# EAGLE design CYM1A113 (EAGLE 7.7.0)
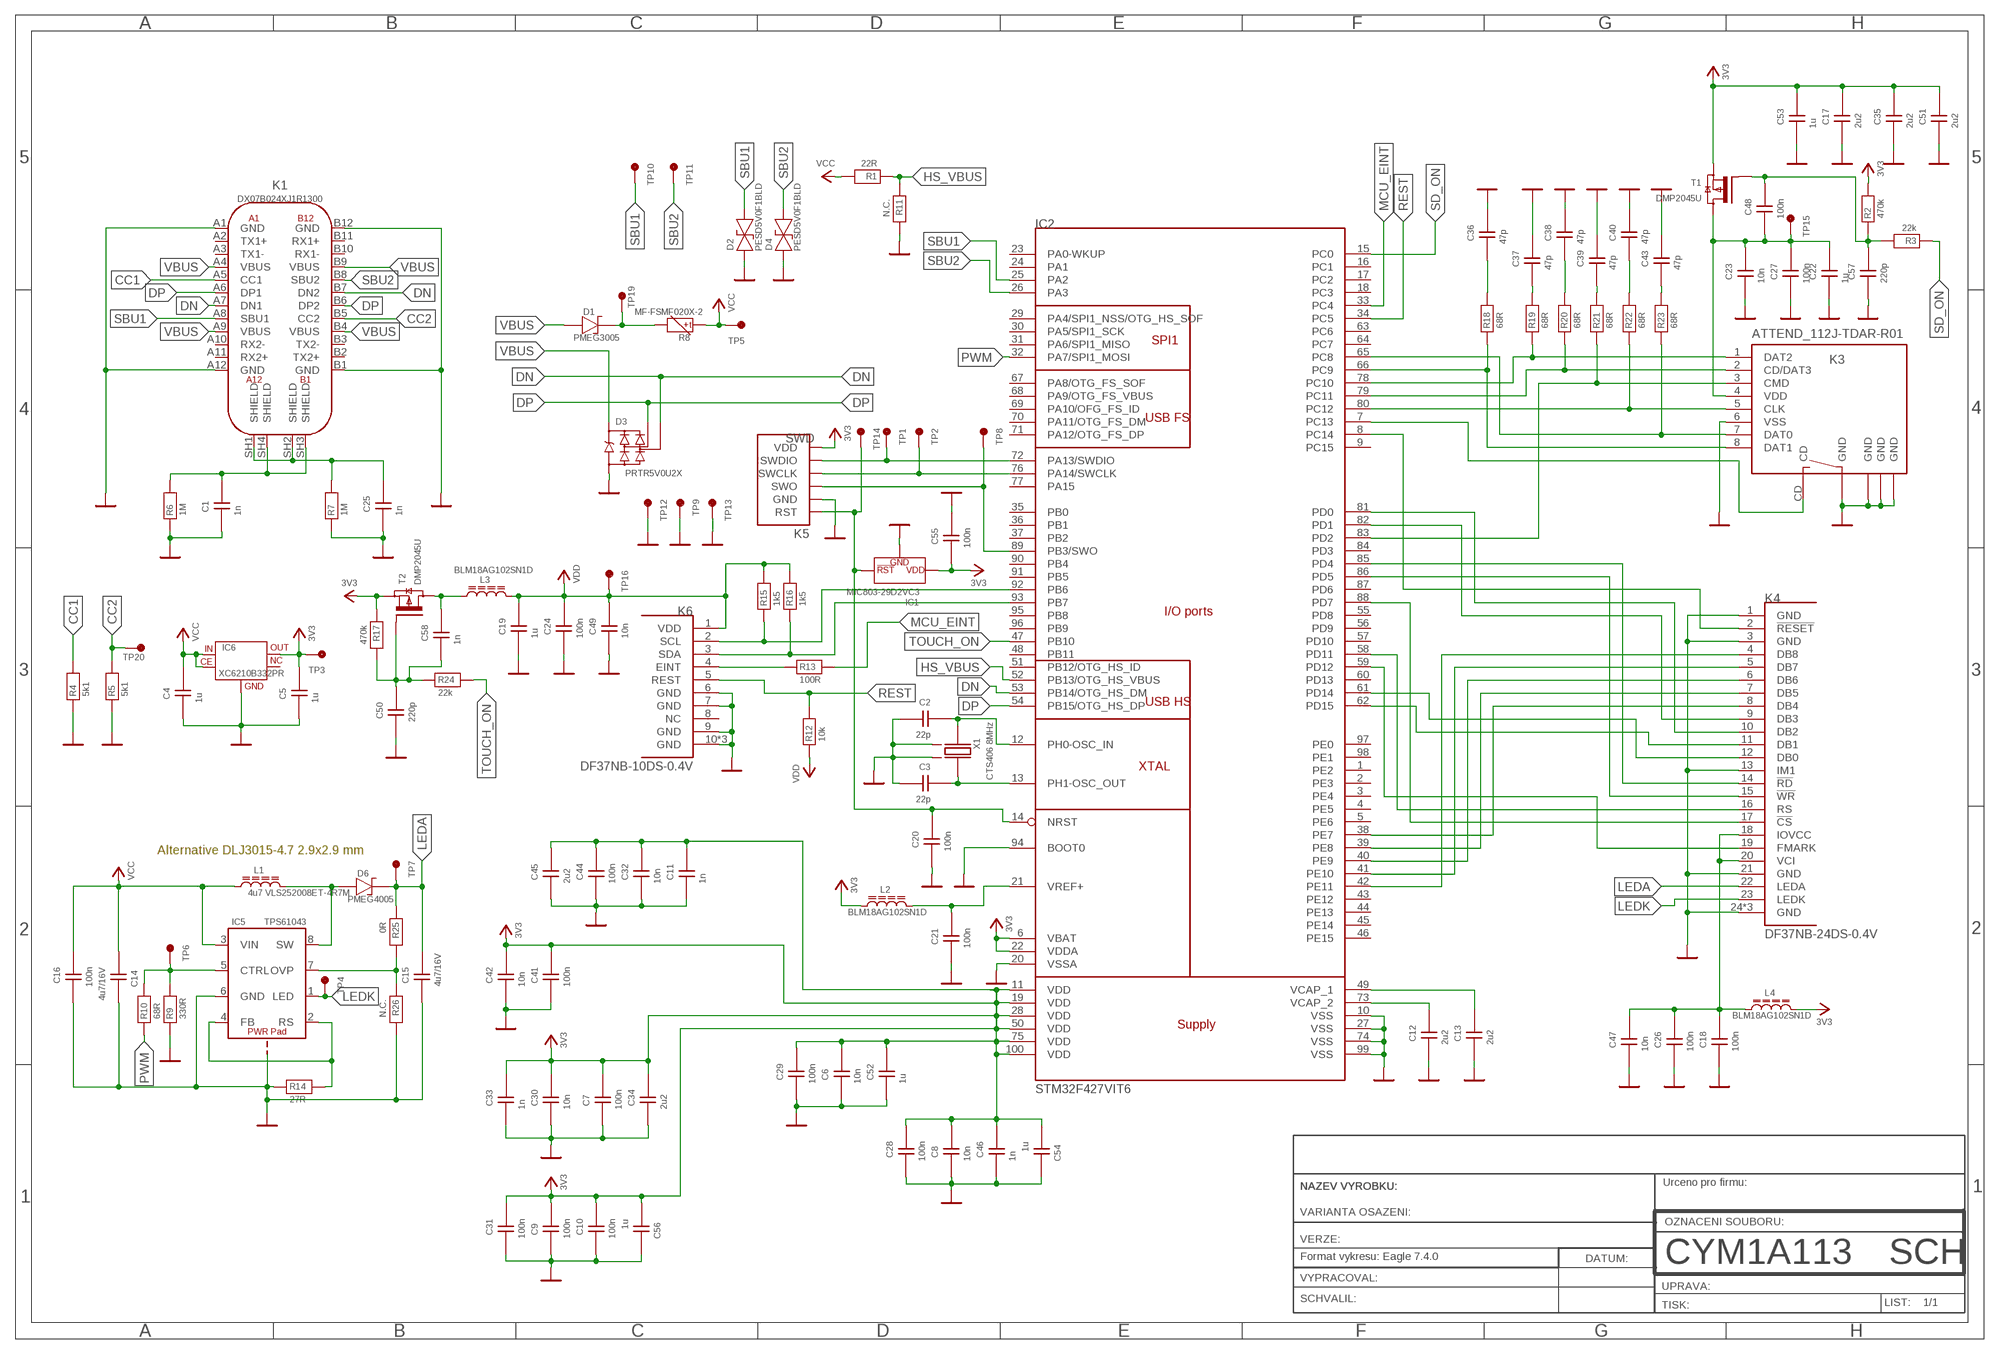
[diagram p0: schematic, sheet 1]

## Parts
C1  1n  C_0402  [0402]
C2  22p  C_0402  [0402]
C3  22p  C_0402  [0402]
C4  1u  C_0603$REFLOW  [0603_REFLOW]
C5  1u  C_0603  [0603]
C6  10n  C_0402  [0402]
C7  100n  C_0402  [0402]
C8  10n  C_0402  [0402]
C9  100n  C_0402  [0402]
C10  100n  C_0402  [0402]
C11  1n  C_0402  [0402]
C12  2u2  C_0805$REFLOW  [0805_REFLOW]
C13  2u2  C_0805$REFLOW  [0805_REFLOW]
C14  4u7/16V  C_0805$REFLOW  [0805_REFLOW]
C15  4u7/16V  C_0805$REFLOW  [0805_REFLOW]
C16  100n  C_0402  [0402]
C17  2u2  C_0805$REFLOW  [0805_REFLOW]
C18  100n  C_0402  [0402]
C19  1u  C_0603$REFLOW  [0603_REFLOW]
C20  100n  C_0402  [0402]
C21  100n  C_0402  [0402]
C22  1u  C_0603$REFLOW  [0603_REFLOW]
C23  10n  C_0402  [0402]
C24  100n  C_0402  [0402]
C25  1n  C_0402  [0402]
C26  100n  C_0402  [0402]
C27  100n  C_0402  [0402]
C28  100n  C_0402  [0402]
C29  100n  C_0402  [0402]
C30  10n  C_0402  [0402]
C31  100n  C_0402  [0402]
C32  10n  C_0402  [0402]
C33  1n  C_0402  [0402]
C34  2u2  C_0805$REFLOW  [0805_REFLOW]
C35  2u2  C_0805$REFLOW  [0805_REFLOW]
C36  47p  C_0402  [0402]
C37  47p  C_0402  [0402]
C38  47p  C_0402  [0402]
C39  47p  C_0402  [0402]
C40  47p  C_0402  [0402]
C41  100n  C_0402  [0402]
C42  10n  C_0402  [0402]
C43  47p  C_0402  [0402]
C44  100n  C_0402  [0402]
C45  2u2  C_0805$REFLOW  [0805_REFLOW]
C46  1n  C_0402  [0402]
C47  10n  C_0402  [0402]
C48  100n  C_0402  [0402]
C49  10n  C_0402  [0402]
C50  220p  C_0402  [0402]
C51  2u2  C_0805$REFLOW  [0805_REFLOW]
C52  1u  C_0603$REFLOW  [0603_REFLOW]
C53  1u  C_0603$REFLOW  [0603_REFLOW]
C54  1u  C_0603$REFLOW  [0603_REFLOW]
C55  100n  C_0402  [0402]
C56  1u  C_0603$REFLOW  [0603_REFLOW]
C57  220p  C_0402  [0402]
C58  1n  C_0402  [0402]
D1  PMEG3005  DS_SOD323F  [SOD323F]
D2  PESD5V0F1BLD  D_TRANSIL_BI_SOD882D  [SOD882D]
D3  PRTR5V0U2X  PRTR5V0_SOT143B$REFLOW  [SOT143B_REFLOW]
D4  PESD5V0F1BLD  D_TRANSIL_BI_SOD882D  [SOD882D]
D6  PMEG4005  DS_SOD323F  [SOD323F]
IC1  MIC803-29D2VC3  MIC803  [SOT23_MEDIUM_SIZE]
IC2  STM32F427VIT6  STM32F427_LQFP100  [LQFP100_NO_CENTER_NO_TDOCU]
IC5  TPS61043  TP6104X_WSON-8_3X3MM  [WSON-8_3X3MM]
IC6  XC6210B332PR  XC6210B_SOT89-5  [SOT89-5]
K1  DX07B024XJ1R1300  USB-C_JAE_DX07B024XJ1  [USB_C_JAE_DX07B024XJ1]
K3  ATTEND_112J-TDAR-R01  KON_µSD_CARD_ATTEND_112J_TXAR_R01_SMALL  [ATTEND_112J-TXAR-R01_SMALL]
K4  DF37NB-24DS-0.4V  DISPLEJ_154A2411CTP01  [DF37NB-24DS-0.4V]
K5  SWD  [SWD]
K6  DF37NB-10DS-0.4V  DISPLEJ_154A2411CTP01_TOUCH  [DF37NB-10DS-0.4V]
L1  4u7 VLS252008ET-4R7M  L_2.5X2.0  [L_2.5X2.0]
L2  BLM18AG102SN1D  L_0603$REFLOW  [0603_REFLOW]
L3  BLM18AG102SN1D  L_0603$REFLOW  [0603_REFLOW]
L4  BLM18AG102SN1D  L_0603$REFLOW  [0603_REFLOW]
R1  22R  R_0402  [0402]
R2  470k  R_0402  [0402]
R3  22k  R_0402  [0402]
R4  5k1  R_0402  [0402]
R5  5k1  R_0402  [0402]
R6  1M  R_0402  [0402]
R7  1M  R_0402  [0402]
R8  MF-FSMF020X-2  POLYSWITCH_0603  [0603]
R9  330R  R_0402  [0402]
R10  68R  R_0402  [0402]
R11  N.C.  R_0402  [0402]
R12  10k  R_0402  [0402]
R13  100R  R_0402  [0402]
R14  27R  R_0402  [0402]
R15  1k5  R_0402  [0402]
R16  1k5  R_0402  [0402]
R17  470k  R_0402  [0402]
R18  68R  R_0402  [0402]
R19  68R  R_0402  [0402]
R20  68R  R_0402  [0402]
R21  68R  R_0402  [0402]
R22  68R  R_0402  [0402]
R23  68R  R_0402  [0402]
R24  22k  R_0402  [0402]
R25  0R  R_0402  [0402]
R26  N.C.  R_0402  [0402]
T1  DMP2045U  PMOS_SOT-23_REF  [SOT23_REFLOW]
T2  DMP2045U  PMOS_SOT-23_REF  [SOT23_REFLOW]
TP1  MB_1.27  [MB1.27]
TP2  MB_1.27  [MB1.27]
TP3  MB_1.50  [MB1.5]
TP4  MB_1.27  [MB1.27]
TP5  MB_1.50  [MB1.5]
TP6  MB_1.27  [MB1.27]
TP7  MB_1.27  [MB1.27]
TP8  MB_1.27  [MB1.27]
TP9  MB_1.27  [MB1.27]
TP10  MB_1.50  [MB1.5]
TP11  MB_1.50  [MB1.5]
TP12  MB_1.27  [MB1.27]
TP13  MB_1.27  [MB1.27]
TP14  MB_1.27  [MB1.27]
TP15  MB_1.27  [MB1.27]
TP16  MB_1.27  [MB1.27]
TP19  MB_1.00  [MB_1.00]
TP20  MB_1.00  [MB_1.00]
X1  CTS406 8MHz  X_4V_6,0X3,5  [X6,0X3,5]

## Nets
CC1: K1.A5(CC1) R4.P$2
CC2: K1.B5(CC2) R5.P$2 TP20.1
CTRL: IC5.5(CTRL) R9.P$2 R10.P$2 TP6.1
DISP_!CS: IC2.88(PD7) K4.17(!CS)
DISP_!RD: IC2.85(PD4) K4.14(!RD)
DISP_!RESET: IC2.8(PC14) K4.2(!RESET)
DISP_!WR: IC2.86(PD5) K4.15(!WR)
DISP_DB0: IC2.61(PD14) K4.12(DB0)
DISP_DB1: IC2.62(PD15) K4.11(DB1)
DISP_DB2: IC2.81(PD0) K4.10(DB2)
DISP_DB3: IC2.82(PD1) K4.9(DB3)
DISP_DB4: IC2.38(PE7) K4.8(DB4)
DISP_DB5: IC2.39(PE8) K4.7(DB5)
DISP_DB6: IC2.40(PE9) K4.6(DB6)
DISP_DB7: IC2.41(PE10) K4.5(DB7)
DISP_DB8: IC2.42(PE11) K4.4(DB8)
DISP_FMARK: IC2.59(PD12) K4.19(FMARK)
DISP_RS: IC2.58(PD11) K4.16(RS)
DISP_VCC: C18.P$2 C26.P$2 C47.P$2 K4.18(IOVCC) K4.20(VCI) L4.1
DN: D3.3(I/O2) IC2.53(PB14/OTG_HS_DM) K1.A7(DN1) K1.B7(DN2)
DP: D3.2(I/O1) IC2.54(PB15/OTG_HS_DP) K1.A6(DP1) K1.B6(DP2)
EINT: K6.4(EINT) R13.P$1
FB_RS: IC5.2(RS) IC5.4(FB) R14.P$2
GND: C1.P$1 C2.P$1 C3.P$1 C4.1 C5.1 C6.P$1 C7.P$1 C8.P$1 C9.P$1 C10.P$1 C11.P$1 C12.1 C13.1 C14.2 C15.1 C16.P$1 C17.1 C18.P$1 C19.1 C20.P$1 C21.P$1 C22.1 C23.P$1 C24.P$1 C25.P$1 C26.P$1 C27.P$1 C28.P$1 C29.P$1 C30.P$1 C31.P$1 C32.P$1 C33.P$1 C34.1 C35.1 C36.P$2 C37.P$2 C38.P$2 C39.P$2 C40.P$2 C41.P$1 C42.P$1 C43.P$2 C44.P$1 C45.1 C46.P$1 C47.P$1 C49.P$1 C50.P$1 C51.1 C52.1 C53.1 C54.2 C55.P$2 C56.2 C57.P$1 D2.1 D3.1(GND) D4.1 IC1.1(GND) IC2.10(VSS) IC2.20(VSSA) IC2.27(VSS) IC2.74(VSS) IC2.94(BOOT0) IC2.99(VSS) IC5.6(GND) IC5.EP IC5.EP$1(EP) IC5.EP$2(EP) IC5.EP$3(EP) IC5.EP$4(EP) IC6.2(GND) K1.A1(GND) K1.A12(GND) K1.B1(GND) K1.B12(GND) K3.6(VSS) K3.GND@1(GND) K3.GND@2(GND) K3.GND@3(GND) K3.GND@4(GND) K4.1(GND) K4.3(GND) K4.13(IM1) K4.21(GND) K4.24(GND) K4.25(GND) K4.26(GND) K5.GND K6.6(GND) K6.7(GND) K6.9(GND) K6.10(GND) K6.11(GND) K6.12(GND) R4.P$1 R5.P$1 R6.P$1 R7.P$1 R9.P$1 R11.P$2 R14.P$1 R26.P$2 TP9.1 TP12.1 TP13.1 X1.2(GND1) X1.4(GND2)
HS_VBUS: IC2.52(PB13/OTG_HS_VBUS) R1.P$1 R11.P$1
LEDA: C15.2 D6.K K4.22(LEDA) R25.P$1 TP7.1
LEDK: IC5.1(LED) K4.23(LEDK) TP4.1
MCU_EINT: IC2.33(PC4) R13.P$2
N$1: C58.P$2 L3.1 T2.3(D)
N$2: C1.P$2 K1.SH3(SHIELD) K1.SH4(SHIELD) R6.P$2
N$3: C25.P$2 K1.SH1(SHIELD) K1.SH2(SHIELD) R7.P$2
N$4: C36.P$1 R18.P$2
N$6: C37.P$1 R19.P$2
N$7: C38.P$1 R20.P$2
N$13: C39.P$1 R21.P$2
N$16: C40.P$1 R22.P$2
N$17: C43.P$1 R23.P$2
N$20: C22.2 C23.P$2 C27.P$2 C48.P$1 K3.4(VDD) T1.3(D) TP15.1
N$21: C2.P$2 IC2.12(PH0-OSC_IN) X1.1
N$22: C3.P$2 IC2.13(PH1-OSC_OUT) X1.3
N$23: C48.P$2 C57.P$2 R2.P$1 R3.P$2 T1.2(G)
N$24: D1.K R8.2 TP19.1
N$25: C12.2 IC2.73(VCAP_2)
N$26: C13.2 IC2.49(VCAP_1)
N$27: C50.P$2 C58.P$1 R17.P$2 R24.P$1 T2.2(G)
OVP: IC5.7(OVP) R25.P$2 R26.P$1
PWM: IC2.32(PA7/SPI1_MOSI) R10.P$1
REST: IC2.34(PC5) K6.5(REST) R12.P$2
RST: C20.P$2 IC1.2(RES) IC2.14(NRST) K5.RST TP14.1
SBU1: D2.2 IC2.25(PA2) K1.A8(SBU1) TP10.1
SBU2: D4.2 IC2.26(PA3) K1.B8(SBU2) TP11.1
SCL: IC2.92(PB6) K6.2(SCL) R15.P$1
SD_CD: IC2.7(PC13) K3.CD
SD_CLK: IC2.80(PC12) K3.5(CLK) R22.P$1
SD_CMD: IC2.83(PD2) K3.3(CMD) R21.P$1
SD_DAT0: IC2.65(PC8) K3.7(DAT0) R23.P$1
SD_DAT1: IC2.66(PC9) K3.8(DAT1) R18.P$1
SD_DAT2: IC2.78(PC10) K3.1(DAT2) R19.P$1
SD_DAT3: IC2.79(PC11) K3.2(CD/DAT3) R20.P$1
SD_ON: IC2.15(PC0) R3.P$1
SDA: IC2.93(PB7) K6.3(SDA) R16.P$1
SW: D6.A IC5.8(SW) L1.2
SWCLK: IC2.76(PA14/SWCLK) K5.SWCLK TP2.1
SWDIO: IC2.72(PA13/SWDIO) K5.SWDIO TP1.1
SWO: IC2.89(PB3/SWO) K5.SWO TP8.1
TOUCH_ON: IC2.47(PB10) R24.P$2
VBUS: D1.A D3.4(VCC) K1.A4(VBUS) K1.A9(VBUS) K1.B4(VBUS) K1.B9(VBUS)
VCC: C4.2 C14.1 C16.P$2 IC5.3(VIN) IC6.1(CE) IC6.4(IN) L1.1 R1.P$2 R8.1 TP5.1
VCC-2: C5.2 C6.P$2 C7.P$2 C8.P$2 C9.P$2 C10.P$2 C11.P$2 C17.2 C28.P$2 C29.P$2 C30.P$2 C31.P$2 C32.P$2 C33.P$2 C34.2 C35.2 C41.P$2 C42.P$2 C44.P$2 C45.2 C46.P$2 C51.2 C52.2 C53.2 C54.1 C55.P$1 C56.1 IC1.3(VDD) IC2.6(VBAT) IC2.11(VDD) IC2.19(VDD) IC2.22(VDDA) IC2.28(VDD) IC2.50(VDD) IC2.75(VDD) IC2.100(VDD) IC6.5(OUT) K5.VCC(VDD) L2.1 L4.2 R2.P$2 R17.P$1 T1.1(S) T2.1(S) TP3.1 ; supply symbol labelled 3V3
VDD: C19.2 C24.P$2 C49.P$2 K6.1(VDD) L3.2 R12.P$1 R15.P$2 R16.P$2 TP16.1
VREF+: C21.P$2 IC2.21(VREF+) L2.2
Unconnected: IC2.1(PE2) IC2.2(PE3) IC2.3(PE4) IC2.4(PE5) IC2.5(PE6) IC2.9(PC15) IC2.16(PC1) IC2.17(PC2) IC2.18(PC3) IC2.23(PA0-WKUP) IC2.24(PA1) IC2.29(PA4/SPI1_NSS/OTG_HS_SOF) IC2.30(PA5/SPI1_SCK) IC2.31(PA6/SPI1_MISO) IC2.35(PB0) IC2.36(PB1) IC2.37(PB2) IC2.43(PE12) IC2.44(PE13) IC2.45(PE14) IC2.46(PE15) IC2.48(PB11) IC2.51(PB12/OTG_HS_ID) IC2.55(PD8) IC2.56(PD9) IC2.57(PD10) IC2.60(PD13) IC2.63(PC6) IC2.64(PC7) IC2.67(PA8/OTG_FS_SOF) IC2.68(PA9/OTG_FS_VBUS) IC2.69(PA10/OFG_FS_ID) IC2.70(PA11/OTG_FS_DM) IC2.71(PA12/OTG_FS_DP) IC2.77(PA15) IC2.84(PD3) IC2.87(PD6) IC2.90(PB4) IC2.91(PB5) IC2.95(PB8) IC2.96(PB9) IC2.97(PE0) IC2.98(PE1) IC6.3(NC) K1.A2(TX1+) K1.A3(TX1-) K1.A10(RX2-) K1.A11(RX2+) K1.B2(TX2+) K1.B3(TX2-) K1.B10(RX1-) K1.B11(RX1+) K6.8(NC)

## Notes on the sheet
- Alternative DLJ3015-4.7 2.9x2.9 mm

## Library data of the parts
C1-C58 = vyber_stara_nemenit:C
D1 D6 = vyber_stara_nemenit:DS
D2 D4 = DZ:D_TRANSIL_BI
D3 = vyber_stara_nemenit:PRTR5V0
IC1 = trezor:MIC803
IC2 = trezor:STM32F427_LQFP100
IC5 = vyber_stara_nemenit:TP6104X
IC6 = trezor:XC6210B
K1 = trezor:USB-C
K3 = SDkarta:KON_µSD_CARD
K4 = trezor:DISPLEJ_154A2411CTP01
K5 = trezor:SWD
K6 = trezor:DISPLEJ_154A2411CTP01_TOUCH
L1 = trezor:L
L2-L4 = vyber_stara_nemenit:L
R1-R7 R9-R26 = vyber_stara_nemenit:R
R8 = vyber_stara_nemenit:POLYSWITCH
T1 T2 = trezor:PMOS
TP1-TP16 = vyber_stara_nemenit:MB
TP19 TP20 = trezor:MB
X1 = trezor:X_4V

## Board
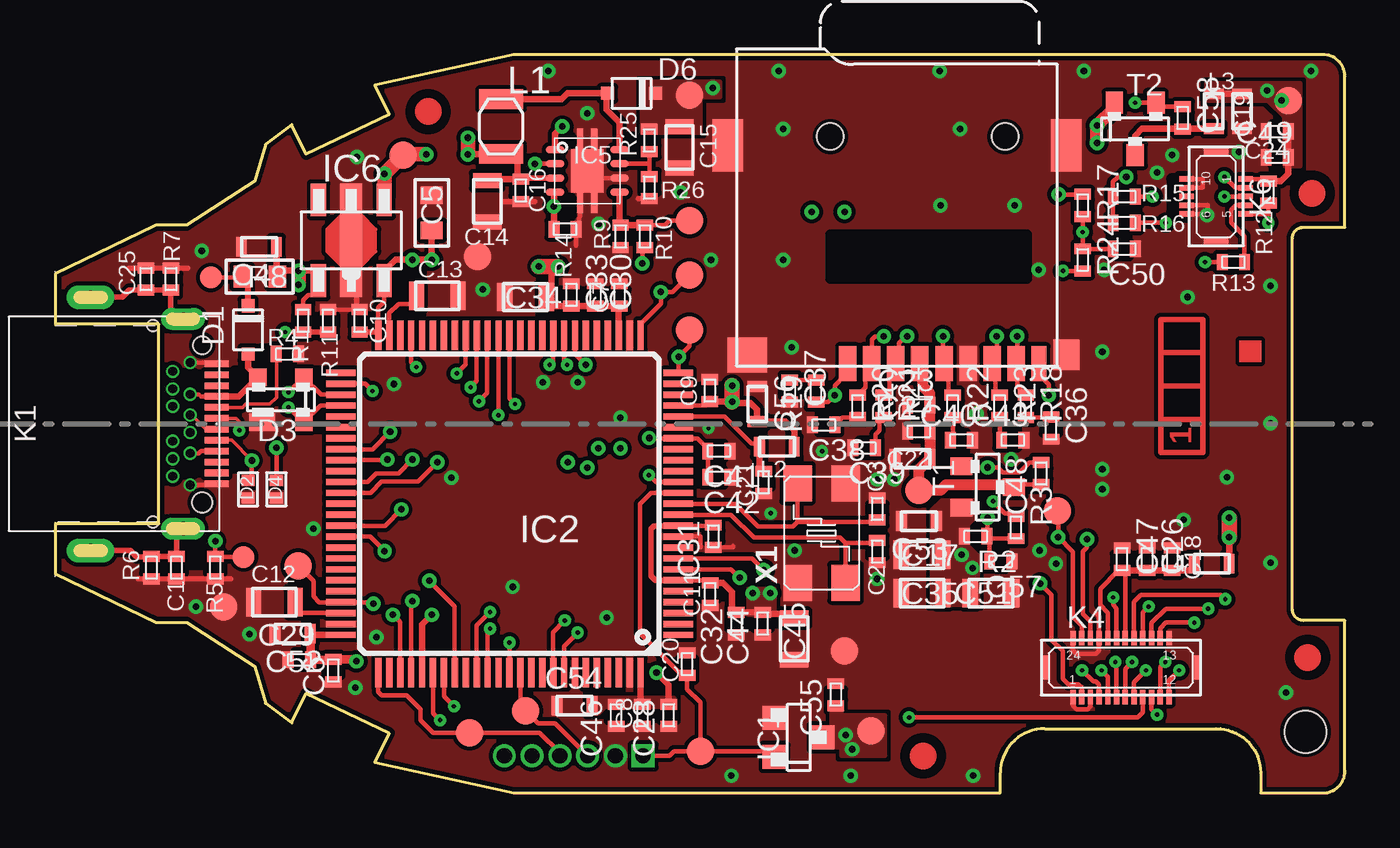
[diagram p1: board, top side]
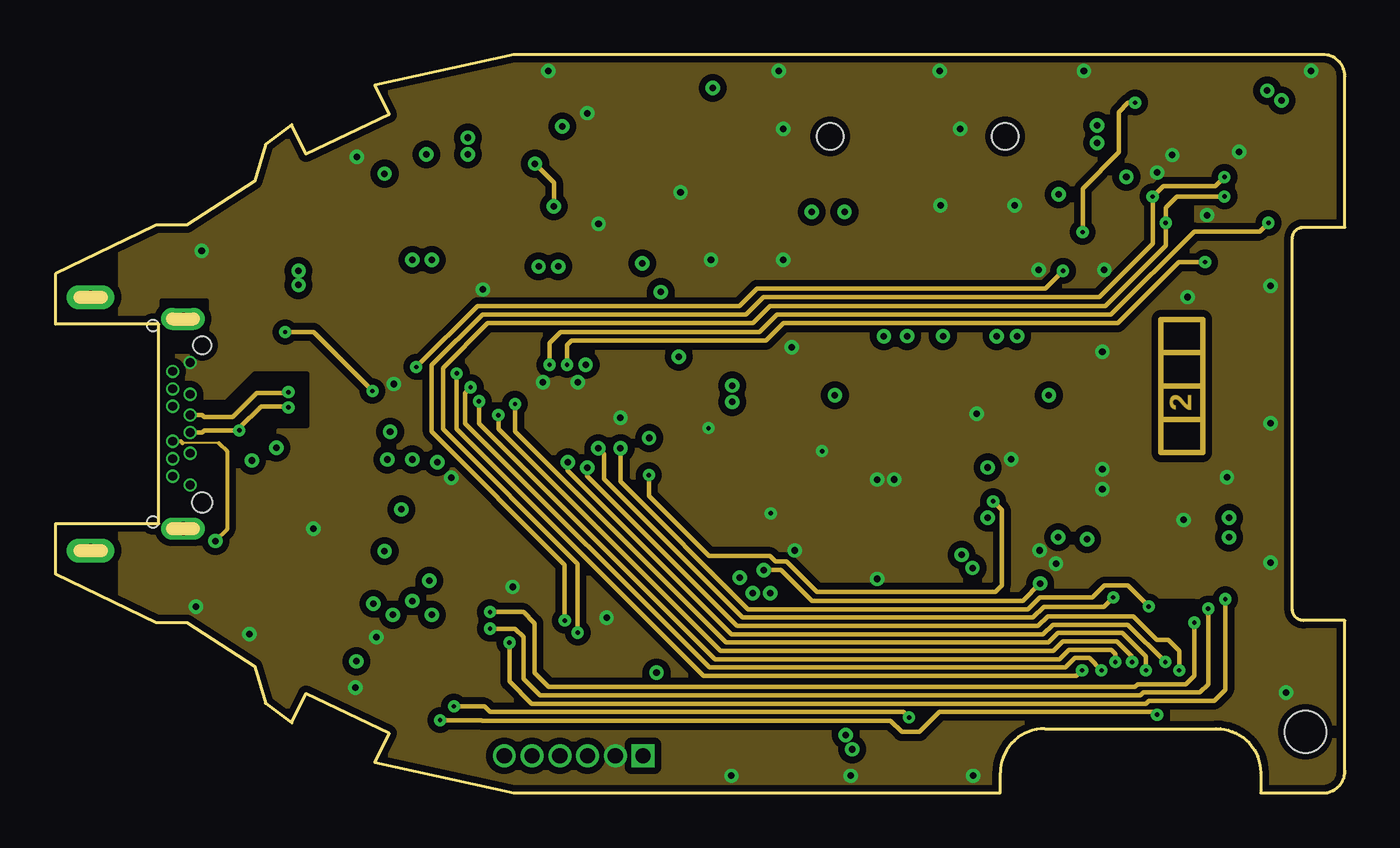
[diagram p2: board, inner layer Route2]
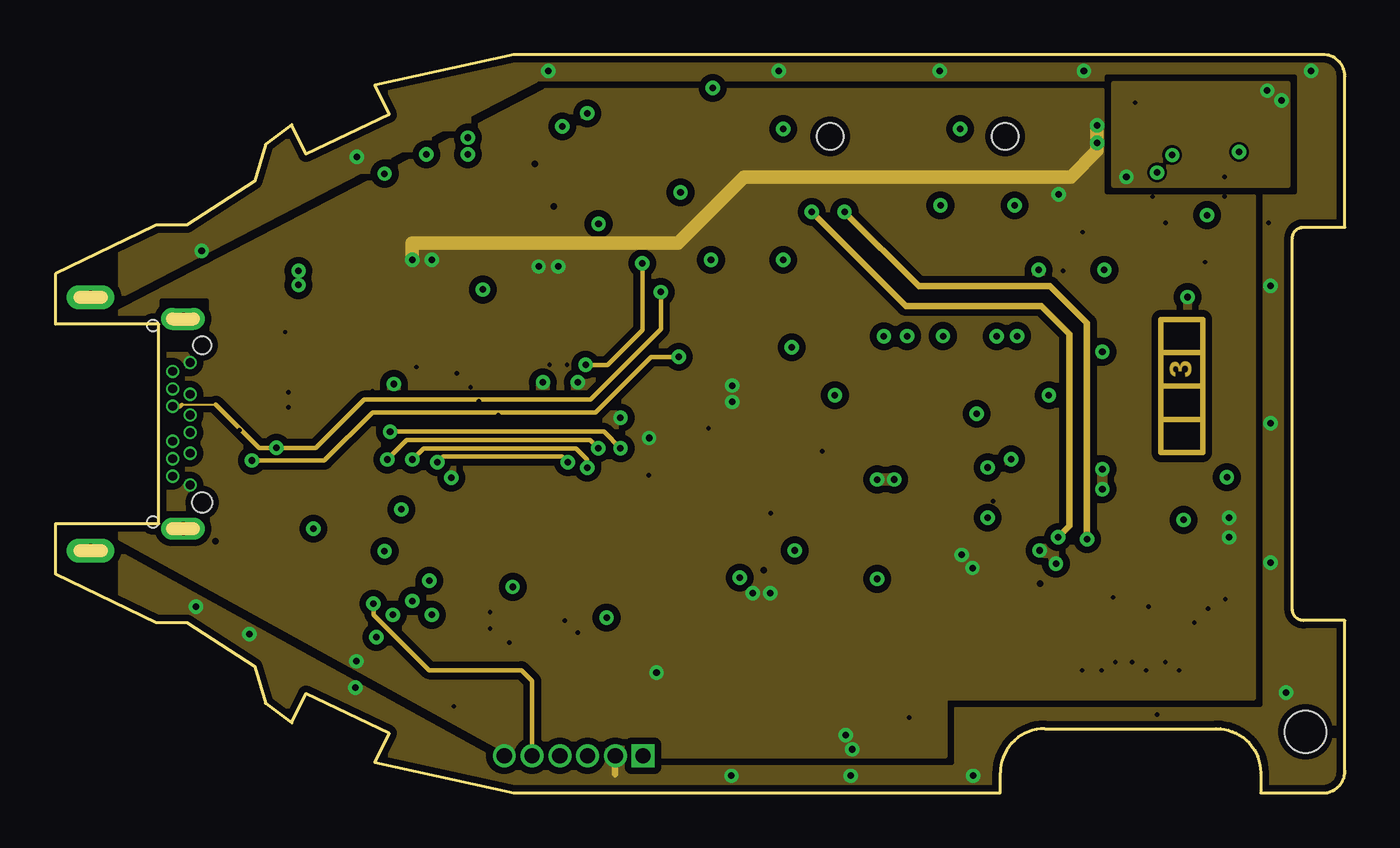
[diagram p3: board, inner layer Route15]
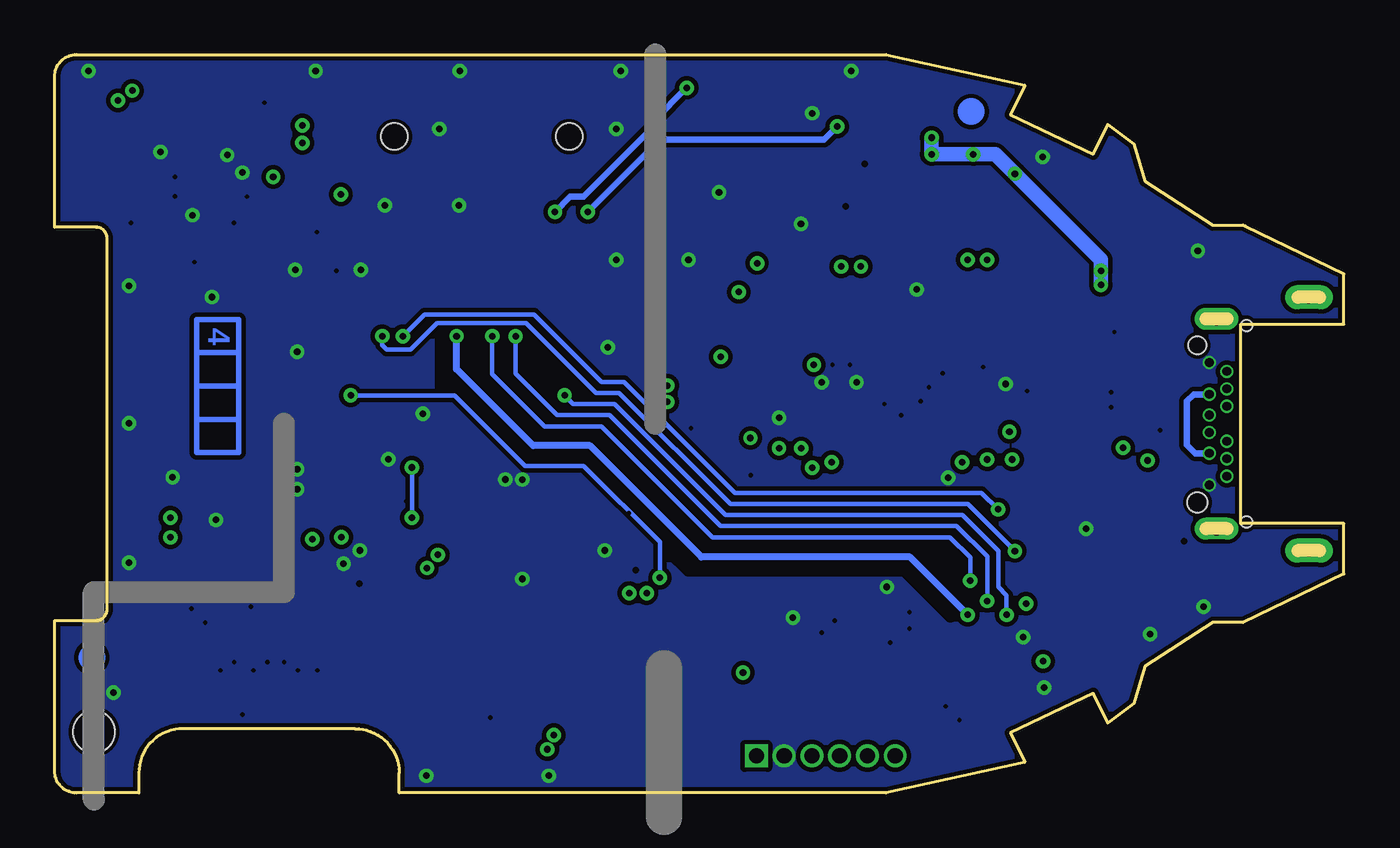
[diagram p4: board, bottom side, seen from below]

Size 59 x 33.8 mm. Coordinates in mm from the lower left corner, seen from the top.
Outline: 58,0 arc90 59,1 59,7.9 57.1,7.9 arc-90 56.6,8.4 56.6,25.4 arc-90 57.1,25.9 59,25.9 59,32.8 arc90 58,33.8 20.95,33.8 14.6,32.4 15.25,31.05 11.45,29.25 10.8,30.6 9.6,29.7 9.1,28 6,26 4.6,26 4.5,25.95 0,23.77 0,21.46 4.71,21.46 4.71,12.33 0,12.33 0,10.03 4.6,7.8 6,7.8 9.1,5.8 9.6,4.1 10.8,3.2 11.45,4.55 15.25,2.75 14.6,1.4 20.95,0 43.23,0 43.23,0.92 arc-90 45.26,2.95 53.12,2.95 arc-90 55.15,0.92 55.15,0 58,0
Copper layers ((1+2)*(15+16)): Top 0.018mm / dielectric 0.2mm / Route2 0.018mm / dielectric 0.452mm / Route15 0.018mm / dielectric 0.2mm / Bottom 0.018mm
Design rules "moje_pravidla_trezor *": minimum track width 0.1mm, minimum drill 0.2mm, track to track 0.12mm, track to pad 0.12mm, pad to pad 0.12mm, via to via 0.12mm, smd to smd 0mil, copper to edge 8mil, drill to drill 8mil, minimum pad ring 3mil, minimum via ring 7mil, stop-mask expansion 4mil, vias tented up to drill 20mil, thermal gap 0.18mm
Holes 1.9 mm at 57.2,2.8
tRestrict: area 56.8,26.7 to 58.2,28.2; area 56.5,5.5 to 58,7; area 16.3,30.4 to 17.8,31.9; area 39,1 to 40.5,2.4; 18 lines
bRestrict: 4 lines

### Footprints (pad centres in the part's own frame; a part is rotated, then mirrored left to right if it is on the bottom)
0402 = smd 0.5 x 0.75: P$1 -0.508,0; P$2 0.508,0
0603_REFLOW = smd 0.5 x 0.9: 1 -0.8,0; 2 0.8,0
0603 = smd 0.8 x 1: 1 -0.8,0; 2 0.8,0
0805_REFLOW = smd 0.7 x 1.3: 1 -0.95,0; 2 0.95,0
SOD323F = smd 0.6 x 0.6: A -1.1,0; K 1.1,0
SOD882D = smd 0.5 x 0.6: 1 -0.4,0; 2 0.4,0
SOT143B_REFLOW = smd 1.2 x 0.8: 1 -0.848,-1.028 | smd 0.8 x 0.8: 2 1.053,-1.028; 3 1.048,1.028; 4 -1.048,1.028
SOT23_MEDIUM_SIZE = smd 1.1 x 1.1: 1 -0.9,-1.1; 2 0.9,-1.1; 3 0,1.1
LQFP100_NO_CENTER_NO_TDOCU = smd 1.35 x 0.29: 1 -7.725,6; 2 -7.725,5.5; 3 -7.725,5; 4 -7.725,4.5; 5 -7.725,4; 6 -7.725,3.5; 7 -7.725,3; 8 -7.725,2.5; 9 -7.725,2; 10 -7.725,1.5; 11 -7.725,1; 12 -7.725,0.5; 13 -7.725,0; 14 -7.725,-0.5; 15 -7.725,-1; 16 -7.725,-1.5; 17 -7.725,-2; 18 -7.725,-2.5; 19 -7.725,-3; 20 -7.725,-3.5; 21 -7.725,-4; 22 -7.725,-4.5; 23 -7.725,-5; 24 -7.725,-5.5; 25 -7.725,-6; 51 7.725,-6; 52 7.725,-5.5; 53 7.725,-5; 54 7.725,-4.5; 55 7.725,-4; 56 7.725,-3.5; 57 7.725,-3; 58 7.725,-2.5; 59 7.725,-2; 60 7.725,-1.5; 61 7.725,-1; 62 7.725,-0.5; 63 7.725,0; 64 7.725,0.5; 65 7.725,1; 66 7.725,1.5; 67 7.725,2; 68 7.725,2.5; 69 7.725,3; 70 7.725,3.5; 71 7.725,4; 72 7.725,4.5; 73 7.725,5; 74 7.725,5.5; 75 7.725,6 | smd 0.29 x 1.35: 26 -6,-7.725; 27 -5.5,-7.725; 28 -5,-7.725; 29 -4.5,-7.725; 30 -4,-7.725; 31 -3.5,-7.725; 32 -3,-7.725; 33 -2.5,-7.725; 34 -2,-7.725; 35 -1.5,-7.725; 36 -1,-7.725; 37 -0.5,-7.725; 38 0,-7.725; 39 0.5,-7.725; 40 1,-7.725; 41 1.5,-7.725; 42 2,-7.725; 43 2.5,-7.725; 44 3,-7.725; 45 3.5,-7.725; 46 4,-7.725; 47 4.5,-7.725; 48 5,-7.725; 49 5.5,-7.725; 50 6,-7.725; 76 6,7.725; 77 5.5,7.725; 78 5,7.725; 79 4.5,7.725; 80 4,7.725; 81 3.5,7.725; 82 3,7.725; 83 2.5,7.725; 84 2,7.725; 85 1.5,7.725; 86 1,7.725; 87 0.5,7.725; 88 0,7.725; 89 -0.5,7.725; 90 -1,7.725; 91 -1.5,7.725; 92 -2,7.725; 93 -2.5,7.725; 94 -3,7.725; 95 -3.5,7.725; 96 -4,7.725; 97 -4.5,7.725; 98 -5,7.725; 99 -5.5,7.725; 100 -6,7.725
WSON-8_3X3MM = smd 0.35 x 0.85: 1 -0.975,-1.475; 2 -0.325,-1.475; 3 0.325,-1.475; 4 0.975,-1.475; 5 0.975,1.475; 6 0.325,1.475; 7 -0.325,1.475; 8 -0.975,1.475 | smd 2 x 1.5: EP 0,0 | smd 1.025 x 0.28: EP$1 -1.425,0.325; EP$2 -1.425,-0.325; EP$3 1.425,-0.325; EP$4 1.425,0.325
SOT89-5 = smd 0.7 x 1.5: 1 -1.5,-1.85; 3 1.5,-1.85; 4 1.5,1.85; 5 -1.5,1.85 | smd 1 x 5.2: 2 0,0
USB_C_JAE_DX07B024XJ1 = smd 0.3 x 1.1: A1 -2.75,5.76; A2 -2.25,5.76; A3 -1.75,5.76; A4 -1.25,5.76; A5 -0.75,5.76; A6 -0.25,5.76; A7 0.25,5.76; A8 0.75,5.76; A9 1.25,5.76; A10 1.75,5.76; A11 2.25,5.76; A12 2.75,5.76 | drill 0.4 pad 0.6: B1 2.8,4.55; B2 2.4,3.75; B3 1.6,3.75; B4 1.35,4.55; B5 0.8,3.75; B6 0.4,4.55; B7 -0.4,4.55; B8 -0.8,3.75; B9 -1.35,4.55; B10 -1.6,3.75; B11 -2.4,3.75; B12 -2.8,4.55 | drill 0.6 pad 1 long: SH1 -4.8,4.225; SH4 4.8,4.225 | drill 0.6 pad 1.1 long: SH2 -5.8,0; SH3 5.8,0 | hole 0.8: -3.6,5.1 | hole 0.9: 3.6,5.1 | hole 0.5: -4.5,2.85; 4.5,2.85
ATTEND_112J-TXAR-R01_SMALL = smd 0.8 x 1.6: 1 2.25,10.4; 2 1.15,10.4; 3 0.05,10.4; 4 -1.05,10.4; 5 -2.15,10.4; 6 -3.25,10.4; 7 -4.35,10.4; 8 -5.45,10.4 | smd 0.7 x 1.6: CD -6.5,10.4 | smd 1.2 x 1.4: GND@1 -7.75,10 | smd 1.4 x 2.4: GND@2 -7.75,0.4; GND@3 7.75,0.4 | smd 1.8 x 1.6: GND@4 6.85,10 | hole 1.2: -4.95,0; 3.05,0
DF37NB-24DS-0.4V = smd 0.25 x 0.65: 1 -2.2,-1.35; 2 -1.8,-1.35; 3 -1.4,-1.35; 4 -1,-1.35; 5 -0.6,-1.35; 6 -0.2,-1.35; 7 0.2,-1.35; 8 0.6,-1.35; 9 1,-1.35; 10 1.4,-1.35; 11 1.8,-1.35; 12 2.2,-1.35; 13 2.2,1.35; 14 1.8,1.35; 15 1.4,1.35; 16 1,1.35; 17 0.6,1.35; 18 0.2,1.35; 19 -0.2,1.35; 20 -0.6,1.35; 21 -1,1.35; 22 -1.4,1.35; 23 -1.8,1.35; 24 -2.2,1.35 | smd 0.4 x 1.1: 25 3.45,0; 26 -3.45,0
SWD = drill 0.7 pad 1: GND 1.27,0; SWCLK 3.81,0; SWDIO 5.08,0; SWO 2.54,0; VCC 6.35,0 | drill 0.7 pad 1 square: RST 0,0
DF37NB-10DS-0.4V = smd 0.25 x 0.65: 1 -0.8,1.35; 2 -0.4,1.35; 3 0,1.35; 4 0.4,1.35; 5 0.8,1.35; 6 0.8,-1.35; 7 0.4,-1.35; 8 0,-1.35; 9 -0.4,-1.35; 10 -0.8,-1.35 | smd 0.4 x 1.1: 11 2.05,0; 12 -2.05,0
L_2.5X2.0 = smd 0.9 x 2: 1 -1.25,0; 2 1.25,0
SOT23_REFLOW = smd 0.8 x 1: 1 0.95,-1.2; 2 -0.95,-1.2; 3 0,1.2
MB1.27 = smd 1.27 x 1.27: 1 0,0
MB1.5 = smd 1.25 x 1.25: 1 0,0
MB_1.00 = smd 1 x 1: 1 0,0
X6,0X3,5 = smd 1.65 x 1.3: 1 -2.275,-1.1; 2 2.275,-1.1; 3 2.275,1.1; 4 -2.275,1.1

### Placement (x,y rotation side)
C1  5.53,10.31 90 top
C2  37.6,11.05 90 top
C3  37.6,13 270 top
C4  9.3,25 0 top
C5  17.21,26.56 270 top
C6  12.7,5.6 90 top
C7  25.8,22.8 270 top
C8  26.85,3.55 90 top
C9  29.94,18.42 270 top
C10  13.91,21.62 270 top
C11  29.95,9.1 90 top
C12  10.01,8.74 0 top
C13  17.46,22.76 180 top
C14  19.75,27.08 270 top
C15  28.55,29.55 90 top
C16  21.28,27.59 90 top
C17  39.65,10.9 0 top
C18  51.1,10.7 270 top
C19  54.3,31.2 90 top
C20  28.9,5.9 270 top
C21  32.4,14.22 90 top
C22  39.2,15.3 0 top
C23  39.5,17.75 0 top
C24  55.9,30.27 0 top
C25  4.13,23.52 270 top
C26  49.95,10.7 270 top
C27  39.5,16.55 0 top
C28  28.05,3.55 90 top
C29  11.15,6.1 0 top
C30  24.7,22.8 270 top
C31  30.1,11.75 90 top
C32  31.15,7.75 90 top
C33  23.6,22.8 270 top
C34  21.5,22.7 0 top
C35  39.65,9.15 0 top
C36  45.55,16.7 270 top
C37  33.6,18.4 270 top
C38  35.15,16.85 180 top
C39  37,15.8 180 top
C40  41.45,16.15 0 top
C41  30.35,15.65 180 top
C42  30.35,14.45 180 top
C43  43.8,16.15 0 top
C44  32.35,7.75 90 top
C45  33.8,7.05 90 top
C46  25.65,3.55 90 top
C47  48.8,10.7 270 top
C48  45.1,14.62 90 top
C49  55.9,29.1 0 top
C50  48.9,24.9 180 top
C51  42.8,9.15 180 top
C52  10.85,7.3 0 top
C53  39.5,12.45 0 top
C54  23.75,4 180 top
C55  35.7,4.5 90 top
C56  32.1,17.8 90 top
C57  43.25,10.6 180 top
C58  51.58,30.9 270 top
D1  8.8,21.2 90 top
D2  8.8,13.9 90 top
D3  10.3,18 0 top
D4  10.1,13.9 90 top
D6  26.36,32.03 0 top
IC1  34,2.55 270 top
IC2  20.77,13.24 180 top
IC5  24.33,28.47 270 top
IC6  13.53,25.3 180 top
K1  1.6,16.9 270 top
K3  38.5,30.05 180 top
K4  48.75,5.74 0 top
K5  26.88,1.7 180 top
K6  53.11,27.3 270 top
L1  20.38,30.51 90 top
L2  33,15.85 180 top
L3  53,31.2 90 top
L4  52.9,10.5 0 top
R1  11.32,21.62 90 top
R2  42.1,11.75 180 top
R3  43.95,12.15 270 top
R4  10.6,20.1 180 top
R5  7.3,10.31 90 top
R6  4.38,10.31 90 top
R7  5.27,23.52 270 top
R8  9.34,23.64 180 top
R9  25.85,25.48 90 top
R10  26.97,25.48 90 top
R11  12.46,21.62 90 top
R12  55.5,27.5 270 top
R13  53.9,24.3 180 top
R14  23.31,25.81 180 top
R15  48.9,27.3 180 top
R16  48.9,26.1 180 top
R17  47,26.9 270 top
R18  44.4,17.7 270 top
R19  34.8,18.4 90 top
R20  36.7,17.7 270 top
R21  37.9,17.7 270 top
R22  41.05,17.7 270 top
R23  43.2,17.7 270 top
R24  47,24.4 270 top
R25  27.17,29.87 270 top
R26  27.17,27.71 270 top
T1  42.65,14 270 top
T2  49.4,30.4 180 top
TP1  11.1,10.4 0 top
TP2  18.95,2.75 0 top
TP3  37.3,2.85 0 top
TP4  45.85,12.9 0 top
TP5  15.9,29.2 0 top
TP6  29,26.2 0 top
TP7  29,31.95 0 top
TP8  21.5,3.75 0 top
TP9  36.1,6.5 0 top
TP10  29,21.2 0 top
TP11  29,23.7 0 top
TP12  19.3,24.55 0 top
TP13  7.68,8.51 0 top
TP14  29.5,1.9 0 top
TP15  39.5,13.85 0 top
TP16  56.4,31.7 0 top
TP19  7.1,23.6 0 top
TP20  8.6,10.8 0 top
U$45  [CENTR]  57.3,6.2 0 top
U$46  [CENTR]  57.5,27.45 0 top
U$47  [BADMARK]  54.67,20.22 0 top
U$48  [CENTR]  17.05,31.19 0 top
U$49  [CENTR]  39.7,1.7 0 top
U$53  [RAM_BRD_ENG]  -109.85,-86.2 0 top  (outside the outline)
U$54  [LAYER_STACK_4_LAYERS]  117.85,75.64 0 top  (outside the outline)
U$56  [CENTR]  57.3,6.2 0 bottom
U$57  [CENTR]  17.05,31.19 0 bottom
X1  35.05,11.9 90 top

### Tracks (layer width: path | path; a pad name or v marks a point on that pad's centre or on a via)
CC1
  Top 0.15: K1.A5 8.55,17.65 8.7,17.8 9.8,17.8 10.1,18.1 R4.P$2
CC2  (via drill 0.3 layers 1-2)
  Top 0.203: v7.3,11.53 R5.P$2 7.3,10.8 TP20.1
  Route2 0.1: 7.47,16.02 5.81,16.02
  Route2 0.178: v7.3,11.53 7.84,12.07 7.84,15.65 7.47,16.02 | 5.81,16.02 5.73,16.1 K1.B5
CTRL
  Top 0.203: R10.P$2 27.88,25.98 28.1,26.2 TP6.1
  Top 0.305: IC5.5 25.8,26.03 R9.P$2 R10.P$2
DISP_!CS  (via drill 0.2 layers 1-2)
  Top 0.203: K4.17 49.35,8.76 49.67,9.07 53.33,9.07 v53.53,8.87 | v20.77,6.89 IC2.88
  Route2 0.203: v53.53,8.87 53.53,4.73 53.02,4.22 50.02,4.22 49.9,4.09 21.78,4.09 20.77,5.11 v20.77,6.89
DISP_!RD  (via drill 0.2 layers 1-2)
  Top 0.203: K4.14 50.55,7.54 50.81,7.8 v52.11,7.8 | v19.88,8.28 19.27,7.67 IC2.85
  Route2 0.203: v52.11,7.8 52.11,5.36 51.73,4.98 49.51,4.98 49.39,4.85 22.54,4.85 21.91,5.49 21.91,7.77 21.4,8.28 v19.88,8.28
DISP_!RESET  (via drill 0.3 layers 1-2)
  Top 0.203: IC2.8 31.87,10.74 v32.4,10.2 | 46.97,4.41 K4.2 46.95,4.83 46.8,4.98 46.34,4.98 46.09,5.23 46.09,6.5 45.58,7.01 45.58,9.06 v45.05,9.59
  Route2 0.203: v45.05,9.59 44.26,8.8 34.6,8.8 33.2,10.2 v32.4,10.2
DISP_!WR  (via drill 0.2 layers 1-2)
  Top 0.203: K4.15 50.15,7.78 50.81,8.44 v52.74,8.44 | v19.88,7.52 19.77,7.41 IC2.86
  Route2 0.203: v52.74,8.44 52.74,4.98 52.36,4.6 49.77,4.6 49.64,4.47 22.16,4.47 21.4,5.23 21.4,7.14 21.02,7.52 v19.88,7.52
DISP_DB0  (via drill 0.2 layers 1-2, 0.3)
  Top 0.203: K4.12 50.95,5.15 v51.42,5.62 | IC2.61 14.27,14.24 14.67,14.63 15.69,14.63 v16.32,15.27
  Route2 0.203: v51.42,5.62 51.42,6.5 50.91,7.01 50.4,7.01 49.33,8.09 45.4,8.09 44.96,7.65 31.18,7.65 24.32,14.51 v24.32,14.89
  Route15 0.203: v16.32,15.27 16.83,15.78 23.81,15.78 24.32,15.27 v24.32,14.89
DISP_DB1  (via drill 0.2 layers 1-2, 0.3)
  Top 0.203: K4.11 50.55,5.76 v50.78,6 | IC2.62 14.41,13.74 14.92,14.25 16.57,14.25 v17.46,15.14
  Route2 0.203: v50.78,6 49.08,7.71 45.63,7.71 45.19,7.27 30.93,7.27 23.43,14.76 v23.43,15.14
  Route15 0.203: v17.46,15.14 17.72,15.39 23.18,15.39 v23.43,15.14
DISP_DB2  (via drill 0.2 layers 1-2)
  Top 0.203: K4.10 50.15,3.83 v50.4,3.58 | IC2.81 17.27,3.65 v17.59,3.33
  Route2 0.203: v50.4,3.58 50.28,3.71 40.45,3.71 39.53,2.79 38.72,2.79 38.21,3.3 19.52,3.3 19.5,3.33 v17.59,3.33
DISP_DB3  (via drill 0.2 layers 1-2)
  Top 0.203: K4.9 49.75,3.69 49.51,3.46 v39.05,3.46 | v18.23,3.96 17.77,4.42 IC2.82
  Route2 0.203: v39.05,3.46 38.8,3.71 19.88,3.71 19.62,3.96 v18.23,3.96
DISP_DB4  (via drill 0.2 layers 1-2)
  Top 0.203: K4.8 49.35,5.07 v49.9,5.62 | IC2.38 20.77,18.06 v21.02,17.81
  Route2 0.203: v49.9,5.62 49.9,6.25 48.82,7.32 45.86,7.32 45.42,6.89 30.67,6.89 21.02,16.54 v21.02,17.81
DISP_DB5  (via drill 0.2 layers 1-2)
  Top 0.203: K4.7 48.95,5.69 v49.26,6 | v20.26,17.3 20.26,20.95 IC2.39
  Route2 0.203: v49.26,6 49.26,6.25 48.57,6.94 46.09,6.94 45.65,6.5 30.42,6.5 20.26,16.66 v20.26,17.3
DISP_DB6  (via drill 0.2 layers 1-2)
  Top 0.203: K4.6 48.55,5.94 v48.5,6 | IC2.40 19.75,20.94 19.75,18.31 v19.37,17.93
  Route2 0.203: v48.5,6 48.5,6.38 48.31,6.56 46.37,6.56 45.93,6.12 30.16,6.12 19.37,16.92 v19.37,17.93
DISP_DB7  (via drill 0.2 layers 1-2)
  Top 0.203: K4.5 48.15,5.33 v47.86,5.62 | v18.99,18.57 19.27,18.85 IC2.41
  Route2 0.203: v18.99,18.57 18.73,18.31 18.73,16.92 29.91,5.74 46.21,5.74 46.65,6.18 47.3,6.18 v47.86,5.62
DISP_DB8  (via drill 0.2 layers 1-2)
  Top 0.203: K4.4 47.75,4.96 47.61,5.11 47.48,5.11 v46.97,5.62 | IC2.42 18.77,19.62 v18.35,19.2
  Route2 0.203: v46.97,5.62 46.72,5.36 29.66,5.36 18.35,16.66 v18.35,19.2
DISP_FMARK  (via drill 0.2 layers 1-2, 0.3)
  Top 0.203: IC2.59 15.15,15.24 v15.18,15.27 | v48.4,8.95 48.4,8.6 48.55,8.45 K4.19
  Route2 0.203: v24.83,15.78 25.08,15.52 25.08,14.38 31.43,8.03 44.73,8.03 45.22,8.52 47.97,8.52 v48.4,8.95
  Route15 0.203: v15.18,15.27 16.07,16.16 24.45,16.16 v24.83,15.78
DISP_RS  (via drill 0.2 layers 1-2, 0.3)
  Top 0.203: K4.16 49.75,8.27 v50.02,8.54 | IC2.58 14.5,15.74 v15.3,16.54
  Route2 0.203: v25.85,15.78 25.85,14.25 31.69,8.41 44.49,8.41 45.04,8.95 47.45,8.95 48,9.5 49.06,9.5 v50.02,8.54
  Route15 0.203: v15.3,16.54 25.08,16.54 v25.85,15.78
DISP_VCC
  Top 0.203: 48.54,10.19 C47.P$2 | K4.18 48.95,9.15 | 48.95,9.15 | K4.20 48.15,8.25 47.8,8.6 47.8,9.35 48.64,10.19 C47.P$2 | C47.P$2 | 48.95,9.15 48.95,10.04 C47.P$2
  Top 0.3: C47.P$2 C26.P$2 C18.P$2 52.09,10.19 52.1,10.2 L4.1
DN  (via drill 0.2 layers 1-2)
  Top 0.15: K1.A7 6.88,16.65 6.23,17.3 K1.B7
  Top 0.2: v10.65,18.35 10.67,18.35 D3.3 12.14,18.23 IC2.53
  Route2 0.2: v10.65,18.35 10.6,18.3 9.2,18.3 8.1,17.2 6.8,17.2 6.7,17.3 K1.B7
DP  (via drill 0.2 layers 1-2)
  Top 0.15: K1.A6 8.25,17.15 8.4,17 v8.4,16.6
  Top 0.2: 11.35,17.05 D3.2 | v10.65,17.65 11.33,16.97 D3.2 | IC2.54 12.12,17.73 D3.2
  Route2 0.2: K1.B6 6.7,16.5 6.8,16.6 v8.4,16.6 8.4,16.7 9.4,17.7 10.6,17.7 v10.65,17.65
EINT
  Top 0.203: K6.4 54,26.9 53.8,26.7 53.8,26.1 54.4,25.5 R13.P$1
FB_RS  (via drill 0.3 layers 1-2)
  Top 0.203: IC5.2 v21.93,28.8 | 22.8,27.43 22.8,27.5 IC5.4 | v22.8,26.85
  Top 0.305: R14.P$2 v22.8,26.85 22.8,27.43
  Route2 0.203: v21.93,28.8 22.8,27.94 v22.8,26.85
GND  (via drill 0.2 layers 1-2, 0.3)
  Top 0.203: K4.24 46.55,6.54 46.72,6.38 47.61,6.38 47.74,6.5 47.74,7.08 K4.21 47.75,8.1 47.6,8.25 | K4.1 46.55,4.01 46.72,3.84 47.23,3.84 47.35,3.96 K4.3 | R11.P$2 13.78,22.12 | 13.78,24.41 13.53,24.41 IC6.2 | 23.81,25.05 R14.P$1 23.94,25.93 23.94,26.32 24,26.38 IC5.EP$3 | IC5.6 24.71,28.15 24.65,28.09 | K1.A1 7.36,19.7 K1.B12 | K1.A12 7.36,14.1 K1.B1 | IC2.10 29.5,11.74 29.5,11.24 | C31.P$1 31,11.24 31,11.3 | K6.10 52.5,28.1 52.5,27.7 K6.9 | K6.7 52.72,26.9 52.72,26.5 K6.6
  Top 0.254: IC5.EP$1 24.65,28.47 | IC5.EP 24.65,28.47 | 24.65,28.47 24.65,28.09 IC5.EP$4 | 13.78,22.12 13.78,24.41 | 6.03,24.03 C25.P$1 3.37,24.03 | 3.78,9.81 R6.P$1 C1.P$1 R5.P$1 8,9.81 8,9.8 | 21.91,27.08 C16.P$1 20.51,27.08 | R26.P$2 26.68,27.2
  Route15 0.3: K5.GND 25.6,0.85
  other vias: 13.71,4.83 14.67,7.14 6.41,8.54 25.85,17.17 22.3,18.8 20.91,9.43 25.21,8.03 30.93,0.79 33.09,33.05 40.45,33.05 55.6,10.55 47.05,33.05 22.54,33.05 13.78,29.11 36.39,0.79 55.6,16.92 55.6,23.21 37.6,9.8 40.49,26.9 24.33,31.11 50.4,28.4 11.8,12.09 15.47,18.72 56.3,4.6 33.69,20.4 47.9,13.9 43.89,26.9 29.99,24.4 41.39,30.4 33.29,30.4 6.68,24.81 29.88,16.7 42.14,17.35 23.9,18.8 18.11,14.43 32.73,12.8 41.99,0.79 33.29,24.4 37.6,14.35 45.77,10.5 51.62,12.5 33.83,11.1 8.86,7.28 43.73,15.28 53.6,14.45 47.9,20.2 38.38,14.35 35.08,15.65 44.99,23.95 24.84,26.05 28.59,27.5 19.54,23.05 51.1,29.2 51.8,22.7 54.15,29.35 57.45,33.05 52.7,26.45 45.02,11.1 47.9,14.83 47.99,23.95
  pour Top (isolate 0.18, rank 2, no thermals): 0.32,34.82 0.32,-0.61 60.4,-0.61 60.4,34.82
  pour Route2 (isolate 0.305, rank 2, no thermals): 0.32,34.7 0.32,-0.73 60.6,-0.73 60.6,34.7
  pour Bottom (isolate 0.203, rank 2, no thermals): 0.32,34.82 0.32,-0.61 60.8,-0.61 60.8,34.82
  pour Route15 (isolate 0.305, rank 3, no thermals): 0.32,34.44 0.32,-0.86 61,-0.86 61,34.44
HS_VBUS  (via drill 0.2 layers 1-2)
  Top 0.203: IC2.52 14.16,18.73 v14.5,18.4 | v10.5,21.1 R1.P$1
  Top 0.254: R1.P$1 R11.P$1
  Route2 0.203: v14.5,18.4 11.8,21.1 v10.5,21.1
LEDA  (via drill 0.3)
  Top 0.203: 27.58,31.9 D6.K | K4.22 47.35,7.85 47,8.2 47,11.05 47.2,11.25 v47.2,11.61
  Route15 0.3: v47.2,11.61 47.2,21.5 45.5,23.2 39.5,23.2 v36.1,26.6
  Bottom 0.3: v36.1,26.6 35.4,27.3 34.8,27.3 31.6,30.5 31.6,30.75 v30.07,32.28
  pour Top (no thermals): 26.84,30.23 29.5,30.23 29.5,31.85 30.4,31.85 30.4,32.56 26.84,32.56
LEDK  (via drill 0.3)
  Top 0.203: K4.23 46.95,7.65 46.55,8.05 46.55,11.04 v45.88,11.71 | 45.88,11.72 v45.88,11.71 | TP4.1 45.88,12.9 v45.88,11.71
  Top 0.305: IC5.1 22.85,30.17 v23.18,30.51
  Route15 0.3: v45.88,11.71 46.4,12.23 46.4,21 45.1,22.3 38.9,22.3 v34.6,26.6
  Bottom 0.3: v34.6,26.6 31.3,29.9 29.5,29.9
  Bottom 0.305: v23.18,30.51 23.19,30.51 23.8,29.9 29.5,29.9
MCU_EINT  (via drill 0.2 layers 1-2)
  Top 0.203: IC2.33 23.27,19.73 v23.4,19.6 | v52.6,24.3 R13.P$2
  Route2 0.203: v23.4,19.6 23.4,20.5 23.6,20.7 32.5,20.7 33.3,21.5 48.6,21.5 51.4,24.3 v52.6,24.3
N$1
  Top 0.3: T2.3 49.4,30.1 49.7,30.4 51.57,30.4 C58.P$2 L3.1
N$2
  Top 0.254: K1.SH3 3.4,11.1 3.7,10.8 4.36,10.8 R6.P$2 C1.P$2 5.53,12.1 K1.SH4
N$3
  Top 0.254: K1.SH2 3.05,22.7 3.37,23.01 C25.P$2 R7.P$2 5.27,21.93 5.5,21.7 K1.SH1
N$4
  Top 0.203: R18.P$2 45.53,17.19 C36.P$1
N$5
  cutout Route2: 6.8,17.7 7.9,17.7 9,18.8 11.3,18.8 11.3,17.2 9.6,17.2 8.6,16.2 8.2,16.2 8.2,15.8 9.1,15.8 10.1,16.8 11.5,16.8 11.5,19.2 9.1,19.2 7.8,17.9 6.8,17.9
N$6
  Top 0.203: C37.P$1 R19.P$2
N$7
  Top 0.203: R20.P$2 36,17.19 C38.P$1
N$8
  cutout Route2 (isolate 0.203): 1.54,23.12 2.07,23.12 2.1,23.12 arc-90 2.48,22.73 arc-90 2.07,22.33 1.54,22.33 1.11,22.33 arc-90 0.7,22.73 arc-90 1.08,23.12
  cutout Route15 (isolate 0.203): 1.08,23.12 2.1,23.12 arc-90 2.48,22.73 arc-90 2.07,22.33 1.11,22.33 arc-90 0.7,22.73 arc-90
  cutout Route2 (isolate 0.203): 1.08,11.51 2.1,11.51 arc-90 2.48,11.13 arc-90 2.07,10.72 1.11,10.72 arc-90 0.7,11.13 arc-90
  cutout Route15 (isolate 0.203): 1.08,11.51 2.1,11.51 arc-90 2.48,11.13 arc-90 2.07,10.72 1.11,10.72 arc-90 0.7,11.13 arc-90
N$9
  cutout Route2 (isolate 0.203): 5.83,22.1 6.31,22.1 arc-90 6.67,21.74 arc-90 6.26,21.34 5.83,21.34 5.32,21.34 arc-90 4.97,21.69 arc-90 5.37,22.1
  cutout Route15 (isolate 0.203): 5.37,22.1 6.31,22.1 arc-90 6.67,21.74 arc-90 6.26,21.34 5.32,21.34 arc-90 4.97,21.69 arc-90
  cutout Route2 (isolate 0.203): 5.37,12.5 6.31,12.5 arc-90 6.67,12.14 arc-90 6.26,11.74 5.32,11.74 arc-90 4.97,12.09 arc-90
  cutout Route15 (isolate 0.203): 5.37,12.5 6.31,12.5 arc-90 6.67,12.14 arc-90 6.26,11.74 5.32,11.74 arc-90 4.97,12.09 arc-90
N$10
  cutout Route2: -0.5,21.05 2.75,21.05 2.75,25.05 -0.5,25.05
  cutout Route2: -0.5,8.65 2.75,8.65 2.75,12.65 -0.5,12.65
  cutout Route15: -0.5,8.65 2.75,8.65 2.75,12.65 -0.5,12.65
  cutout Route15: -0.5,21.05 2.75,21.05 2.75,25.05 -0.5,25.05
N$11
  cutout Route2: 4.85,22.55 6.9,22.55 6.9,20.2 4.85,20.2
  cutout Route15: 4.85,22.55 6.9,22.55 6.9,20.3 4.85,20.3
N$12
  cutout Route2: 5.7,14.5 6.6,14.5 6.6,13.65 5.7,13.65
N$13
  Top 0.203: C39.P$1 37.51,16.41 37.7,16.6 37.7,16.99 R21.P$2
N$14
  Top 0.254: 52.49,20.15 52.49,21.68 50.58,21.68 50.58,20.15 | 52.49,20.15 52.49,18.63 | 52.49,18.63 52.49,17.11 | 52.49,17.11 52.49,15.58 50.58,15.58 50.58,17.11 | 50.58,17.11 50.58,18.63 | 50.58,18.63 50.58,20.15 | 50.58,18.63 52.49,18.63 | 50.58,17.11 52.49,17.11 | 50.58,20.15 52.49,20.15
N$15
  Route2 0.254: 52.49,17.11 52.49,15.58 50.58,15.58 50.58,17.11 | 52.49,17.11 52.49,18.63 | 52.49,18.63 52.49,20.15 | 52.49,20.15 52.49,21.68 50.58,21.68 50.58,20.15 | 50.58,20.15 50.58,18.63 | 50.58,18.63 50.58,17.11 | 50.58,17.11 52.49,17.11 | 50.58,18.63 52.49,18.63 | 50.58,20.15 52.49,20.15
N$16
  Top 0.203: R22.P$2 41.05,16.15 C40.P$1
N$17
  Top 0.203: R23.P$2 43.2,16.15 C43.P$1
N$18
  cutout Route2: 50.7,8.5 52.1,8.5 52.1,8.8 50.7,8.8
N$19
  cutout Route2: 51.9,26.8 52,26.8 52,26.3 51.9,26.3
N$20
  Top 0.2: C48.P$1 43.85,14.12 T1.3
  Top 0.5: T1.3 43.75,14.1 40.75,14.1 40.5,13.85 TP15.1 39.5,14.8 C22.2 C27.P$2 C23.P$2 40.01,18.29 39.7,18.6 39.7,19.5 K3.4
N$21
  Top 0.203: IC2.12 30.91,12.74 31.95,11.7 35.9,11.7 36.15,11.45 | 36.15,11.45 37.6,11.45 C2.P$2 | X1.1 36.15,11.45
N$22
  Top 0.203: X1.3 33.95,12.4 | 33.95,12.4 33.75,12.2 32.15,12.2 31.12,13.24 IC2.13 | 33.95,12.4 37.6,12.4 C3.P$2
N$23  (via drill 0.3)
  Top 0.2: v42.65,14.9 43.12,14.9 43.35,14.68 44.1,14.68 44.55,15.12 C48.P$2
  Top 0.203: C57.P$2 42.74,11.62 R2.P$1 42.65,11.79 | R3.P$2 42.8,11.64 42.65,11.79 | 42.65,11.79 v42.65,12.6 | v42.65,14.9 41.45,14.9 T1.2
  Bottom 0.203: v42.65,12.6 v42.65,14.9
N$24
  Top 0.2: TP19.1 8.54,23.6 R8.2
  Top 0.27: D1.K 8.8,23.64
  Top 0.28: 8.8,23.64 R8.2
N$25
  Top 0.203: IC2.73 10.96,8.24 C12.2
N$26
  Top 0.203: IC2.49 15.27,21.96 15.69,22.38 16.51,22.38 C13.2
N$27  (via drill 0.2 layers 1-2)
  Top 0.2: C50.P$2 R24.P$1 v47,25.67 R17.P$2 | v49.4,31.6 T2.2 50.54,31.41 C58.P$1
  Route2 0.2: v49.4,31.6 49.08,31.6 48.65,31.17 48.65,29.32 47,27.67 v47,25.67
N$65
  Route15 0.254: 52.49,17.11 52.49,15.58 50.58,15.58 50.58,17.11 | 52.49,17.11 52.49,18.63 | 52.49,18.63 52.49,20.15 | 52.49,20.15 52.49,21.68 50.58,21.68 50.58,20.15 | 50.58,20.15 50.58,18.63 | 50.58,18.63 50.58,17.11 | 50.58,17.11 52.49,17.11 | 50.58,18.63 52.49,18.63 | 50.58,20.15 52.49,20.15
N$66
  Bottom 0.254: 52.49,17.11 52.49,15.58 50.58,15.58 50.58,17.11 | 52.49,17.11 52.49,18.63 | 52.49,18.63 52.49,20.15 | 52.49,20.15 52.49,21.68 50.58,21.68 50.58,20.15 | 50.58,20.15 50.58,18.63 | 50.58,18.63 50.58,17.11 | 50.58,17.11 52.49,17.11 | 50.58,18.63 52.49,18.63 | 50.58,20.15 52.49,20.15
OVP
  Top 0.203: R25.P$2 27.17,28.8 | 27.17,28.8 R26.P$1 | IC5.7 27.17,28.8
PWM  (via drill 0.3)
  Top 0.203: IC2.32 23.77,20.08 v24.25,19.6 | R10.P$1 26.85,24.85 v26.85,24.25
  Route15 0.203: v24.25,19.6 25.25,19.6 26.85,21.2 v26.85,24.25
REST  (via drill 0.2 layers 1-2)
  Top 0.2: K6.5 55.5,26.5 v55.5,26.1 R12.P$2
  Top 0.203: IC2.34 22.77,19.77 v22.6,19.6 | K6.5
  Route2 0.203: v22.6,19.6 22.6,20.6 23.1,21.1 32.2,21.1 33,21.9 48.3,21.9 52.1,25.7 55.1,25.7 v55.5,26.1
RST
  Top 0.2: 28.1,5.95 28.66,5.39 C20.P$2 28.9,4.75 29.5,4.15 TP14.1 32.9,1.9 IC1.2
  Top 0.203: IC2.14 27.23,13.74 26.73,13.24 26.73,7.32 28.1,5.95 | K5.RST 28.1,1.7 28.3,1.9 29.1,1.9 29.2,1.8 29.4,1.8 TP14.1
SBU1  (via drill 0.3, 0.3 pad 0.5)
  Top 0.15: K1.A8 8.04,16.15 v8.97,15.22
  Top 0.203: IC2.25 28.51,19.26 v28.51,19.97 29,20.45 TP10.1 | v8.97,15.22 8.97,14.47 D2.2
  Route15 0.203: v8.97,15.22 12.29,15.22 14.49,17.43 24.7,17.43 27.24,19.97 v28.51,19.97
SBU2  (via drill 0.3)
  Top 0.203: 26.76,20.93 IC2.26 | IC2.26 | v10.1,15.8 D4.2 | TP11.1 28.23,22.93 v27.7,22.93 27.7,22.39 26.77,21.47 IC2.26
  Route15 0.1: 5.77,17.77 7.32,17.77
  Route15 0.178: K1.B8 5.7,17.7 5.77,17.77
  Route15 0.203: v27.7,22.93 27.7,21.23 24.47,18.01 14.11,18.01 11.9,15.8 v10.1,15.8 9.3,15.8 7.32,17.77
SCL  (via drill 0.2 layers 1-2)
  Top 0.203: v23.3,7.89 22.77,7.36 IC2.92 22.75,5.51 | K6.2 53.97,27.7 v53.49,28.19 | R15.P$1 v50.2,27.3
  Route2 0.203: v53.49,28.19 53.08,27.79 50.69,27.79 v50.2,27.3 50.2,25.14 47.76,22.7 32.4,22.7 31.6,21.9 19.52,21.9 17.21,19.58 17.21,16.54 23.3,10.45 v23.3,7.89
SD_CD  (via drill 0.3)
  Top 0.2: K3.CD 45.1,19.65
  Top 0.203: IC2.7 30.91,10.24 v31.3,9.85 | 45.1,19.65 45.1,19.05 45.45,18.7 v45.45,18.2
  Bottom 0.2: 40.7,18.2 v45.45,18.2
  Bottom 0.203: 40.7,18.2 37.48,14.97 34.79,14.97 31.3,11.48 v31.3,9.85
SD_CLK  (via drill 0.3)
  Top 0.203: R22.P$1 40.85,18.21 40.85,19.65 K3.5 40.6,19.65 v40.6,20.91
  Top 0.3: IC2.80 16.77,7.71 v17.21,8.16
  Bottom 0.32: v17.21,8.16 19.86,10.8 29.4,10.8 34.5,15.9 37.1,15.9 40.6,19.4 v40.6,20.91
SD_CMD  (via drill 0.3)
  Top 0.203: IC2.83 18.27,8.55 v17.1,9.72 | v38.97,20.91 38.91,20.91 38.6,20.6 38.6,19.8 K3.3 38.15,19.65 38.15,18.21 R21.P$1
  Bottom 0.203: v38.97,20.91 38.97,19.17 36.58,16.78 33.97,16.78 28.89,11.7 18.03,11.7 17.1,10.78 v17.1,9.72
SD_DAT0  (via drill 0.3)
  Top 0.2: v43.06,20.9 43.06,19.94
  Top 0.203: IC2.65 15.07,12.24 v15.81,12.98 | 43.06,19.94 42.85,19.72 K3.7 43,19.65 43,18.21 R23.P$1
  Bottom 0.203: v15.81,12.98 16.57,13.74 27.85,13.74 32.93,18.82 33.97,18.82 37.05,21.9 42.07,21.9 v43.06,20.9
SD_DAT1  (via drill 0.3)
  Top 0.203: v15.05,11.08 14.39,11.74 IC2.66 | v44.01,20.91 44.01,19.65 | 44.01,19.65 K3.8 | 44.01,19.65 44.01,18.6 R18.P$1
  Bottom 0.203: v15.05,11.08 17.21,13.24 28.08,13.24 33.16,18.31 34.23,18.31 37.41,21.5 41.5,21.5 42.7,20.3 43.8,20.3 44.01,20.51 v44.01,20.91
SD_DAT2  (via drill 0.3)
  Top 0.203: IC2.78 15.77,7.82 v15.43,8.16 | K3.1 36.1,19.5 36.1,19.1 35.66,18.66 v35.66,18.2 35.35,17.89 R19.P$1
  Bottom 0.203: v15.43,8.16 15.43,9.04 15.81,9.43 15.81,11.08 17.46,12.73 28.3,12.73 33.38,17.81 35.26,17.81 v35.66,18.2
SD_DAT3  (via drill 0.3)
  Top 0.203: IC2.79 16.27,8.79 v16.32,8.79 | 37.51,19.49 K3.2 | K3.2 37.35,20.75 37.5,20.9 v37.9,20.9 | K3.2 37.05,19.65 37.05,18.56 R20.P$1
  Bottom 0.203: v16.32,8.79 16.32,10.82 17.72,12.22 28.53,12.22 33.61,17.3 36,17.3 37.9,19.2 v37.9,20.9
SD_ON  (via drill 0.2 layers 1-2)
  Top 0.203: IC2.15 27.47,14.24 v27.15,14.55 | v42.9,13.35 43.45,12.8 43.81,12.8 R3.P$1
  Route2 0.203: v27.15,14.55 27.15,13.6 29.9,10.85 32.7,10.85 32.95,10.6 33.45,10.6 34.85,9.2 43,9.2 43.3,9.5 43.3,12.95 v42.9,13.35
SDA  (via drill 0.2 layers 1-2)
  Top 0.203: IC2.93 23.27,6.72 v23.89,7.34 | K6.3 v53.49,27.3 | R16.P$1 v50.8,26.1
  Route2 0.203: v53.49,27.3 51.3,27.3 50.8,26.8 v50.8,26.1 50.8,25.06 48.04,22.3 32.7,22.3 31.9,21.5 19.76,21.5 17.72,19.46 17.72,16.66 23.89,10.5 v23.89,7.34
SW
  Top 0.305: IC5.8 25.8,30.68 25.21,31.27 25.21,31.99 D6.A 23.43,32.03 23.16,31.76 L1.2
SWCLK
  Top 0.203: IC2.76 14.77,4.63 14.92,4.47 16.07,4.47 16.7,3.84 16.7,3.33 17.28,2.75 TP2.1 22.15,2.75 23.07,1.83 K5.SWCLK
SWDIO  (via drill 0.3)
  Top 0.203: v14.54,8.66 14.47,8.74 IC2.72 12.07,8.74 11.8,9 11.8,9.7 TP1.1
  Route15 0.203: v14.54,8.66 14.54,8.16 17.08,5.62 21.31,5.62 21.8,5.13 K5.SWDIO
SWO
  Top 0.203: IC2.89 21.27,3.75 TP8.1 22.07,3.18 22.86,3.18 K5.SWO
TOUCH_ON  (via drill 0.2 layers 1-2)
  Top 0.2: IC2.47 16.27,19.73 v16.5,19.5 | v46.1,23.9 R24.P$2
  Route2 0.2: v46.1,23.9 45.3,23.1 32.1,23.1 31.3,22.3 19.3,22.3 v16.5,19.5
VBUS
  Top 0.203: K1.B4 6.55,15.55 6.65,15.65 K1.A9 | K1.B9 6.55,18.25 6.65,18.15 K1.A4
  Top 0.3: K1.A4 8.37,18.15 D3.4 8.8,19.48 D1.A
  Bottom 0.305: K1.B9 6.86,18.25 7.18,17.93 7.18,15.92 6.8,15.55 K1.B4
VCC  (via drill 0.3)
  Top 0.203: R1.P$2 11.32,22.57 11.55,22.8 12.03,22.8 IC6.4 | TP5.1 v15.05,28.35
  Top 0.254: IC5.3 21.33,28.15 C16.P$2
  Top 0.3: IC6.4 12.03,23.9 v11.11,23.9 10.14,23.9 R8.1 10.1,23.64 C4.2
  Top 0.305: C14.1 19.82,28.09 C16.P$2 21.15,28.09 21.15,29.26 L1.1 20.38,29.24 v18.86,29.24 | IC6.4 11.88,23.45 | IC6.1 15.05,27.17 15.05,27.2
  Top 0.656: v11.11,23.25 v11.11,23.9 | v16.96,29.24 15.94,29.24 v15.05,28.35 15.05,27.2 | v18.86,30 v18.86,29.24
  Bottom 0.656: v11.11,23.25 v11.11,23.9 11.11,24.41 v15.05,28.35 15.94,29.24 v18.86,29.24 v18.86,30
VCC-2  (via drill 0.3)
  Top 0.2: IC2.6 29.95,9.74 C11.P$2 | v45.9,27.4 R17.P$1
  Top 0.203: IC2.75 13.02,7.27 | IC2.50 14.77,22.22 15.03,22.48 IC6.5 | IC2.22 29.76,17.73 C9.P$2 | v27.16,16.25 27.17,16.23 IC2.19 29.37,16.23 29.84,15.76 C41.P$2 C42.P$2 | IC2.11 30.1,12.24 C31.P$2
  Top 0.254: IC2.11 27.39,12.24 27.24,12.09 27.24,9.93 27.44,9.74 IC2.6 | IC2.50 14.77,21.11 C10.P$2
  Top 0.3: v27.5,5.52 27.5,5.5 28.05,4.95 C28.P$2 | C34.2 22.7,22.7 | 22.7,22.7 22.7,24.1 | 22.7,22.7 22.7,22.29 C33.P$2 C30.P$2 C7.P$2 25.77,22.29 IC2.28 | v53.7,11.7 L4.2 | IC2.75 11.65,7.24 C52.2 | C44.P$2 32.41,8.2 33.8,8.2 C45.2 | C44.P$2 C32.P$2 30.95,8.26 30.95,9.2 30.54,9.61 C11.P$2 | 31.91,8.26 C44.P$2 | L2.1 33.8,16.6 33.4,17 C56.1 32.1,17.55 31.8,17.85 31.01,17.85 v30.96,17.9 30.94,17.91 C9.P$2 | IC2.100 26.77,4.06 C8.P$2
  Top 0.305: IC6.5 15.03,23.88 15.56,24.41 v16.32,24.41 v17.21,24.41 C5.2
  Top 0.4: v13.76,6.03 13.76,6.11 C6.P$2 C29.P$2 C52.2
  Top 0.6: T2.1 48.45,31.35 v47.66,30.56 v47.66,29.76
  Top 0.7: v30.96,18.65 v30.96,17.9 | v53.7,12.6 v53.7,11.7 | v22.1,24.1 22.7,24.1 v23,24.1
  Route15 0.61: v47.66,30.56 47.66,29.41 46.45,28.2 31.5,28.2 28.47,25.17 16.32,25.17 v16.32,24.41
  other vias: 32.71,9.15 36.15,2.65 36.45,2 31.91,9.15 41.96,10.3 41.46,10.9
  pour Route15 (isolate 0.305, rank 2, no thermals): 2.61,21.87 2.61,11.84 21.02,1.7 40.7,1.7 40.7,4.35 54.8,4.35 54.8,27.3 47.9,27.3 47.9,32.16 22.42,32.16
  pour Top (no thermals): 34.65,2.1 34.65,3 35.5,3 35.5,4.15 35.95,4.15 35.95,3.55 37.95,3.55 37.95,1.7 35.95,1.7 35.95,2.1
  pour Top (no thermals): 31.7,8.15 31.7,9.35 32.9,9.35 32.9,8.15
  pour Top (no thermals): 42.2,8.6 40.1,8.6 40.1,12.95 40.55,13.4 42.05,13.4 42.05,12.6 41.75,12.3 41.75,11.3 42.2,10.85
  pour Top (no thermals): 24.4,4.35 28.3,4.35 28.3,3.95 25.15,3.95 24.85,3.65 24.4,3.65
VDD  (via drill 0.3)
  Top 0.2: 54.05,32 C19.2 | K6.1 55.4,28.1 R12.P$1 | v49,28.2 48.6,28.2 48.39,27.99 R15.P$2 R16.P$2
  Top 0.3: L3.2 54.05,32 | C24.P$2 C49.P$2 56.41,28.36 56.06,28.01 R12.P$1
  other vias: 55.45,32.15 56.1,31.7
  pour Route15: 48.4,27.8 48.4,32.5 56.4,32.5 56.4,27.8
  pour Top (no thermals): 52.65,31.7 55.47,31.7 56.22,30.95 56.22,28.7 56.95,28.7 56.95,32.5 52.65,32.5
VREF+
  Top 0.203: IC2.21 30.62,17.23 31.85,16 32.2,16 L2.2 32.2,15.95
  Top 0.3: L2.2 32.2,14.73 C21.P$2

### Text on the board
Top: 1
Route2: 2
Route15: 3
Bottom: 4
tStop: 13 | TOP
bStop: BOT
Document: LAYER DETAIL | SOLDERMASK (TOP SIDE) | LAYER 1 (TOP) | 18 µm Cu + (25 ± 10) µm plating | CORE 0.2 mm | LAYER 2 | 18 µm Cu | 4x PREPREG 2116 | (0.98 ± 0.1) mm | (4x 113µm) | LAYER 3 | 18 µm Cu | CORE 0.2 mm | LAYER 4 (BOTTOM) | 18 µm Cu + (25 ± 10) µm plating | SOLDERMASK (BOTTOM SIDE) | 59.0 x 33.8 mm | ±0.1 mm | SEE LAYER DETAIL | FR4, Tg = min. 170°C | ENIG | milling
Drill_legend: Vrtaci plan | Vytvoreno : 24.7.2018 16:46 | 1.9000 mm / 74.803 mil | 1.2000 mm / 47.244 mil | 0.9000 mm / 35.433 mil | 0.8000 mm / 31.496 mil | 0.7000 mm / 27.559 mil | 0.6000 mm / 23.622 mil | 0.5000 mm / 19.685 mil | 0.4000 mm / 15.748 mil | 0.3000 mm / 11.811 mil | 0.2000 mm / 7.874 mil